# EAGLE schematic main (EAGLE 9.4.2)
CNAME: Arduino Sousvide; CREVISION: v1.1; DESIGNER: SSE
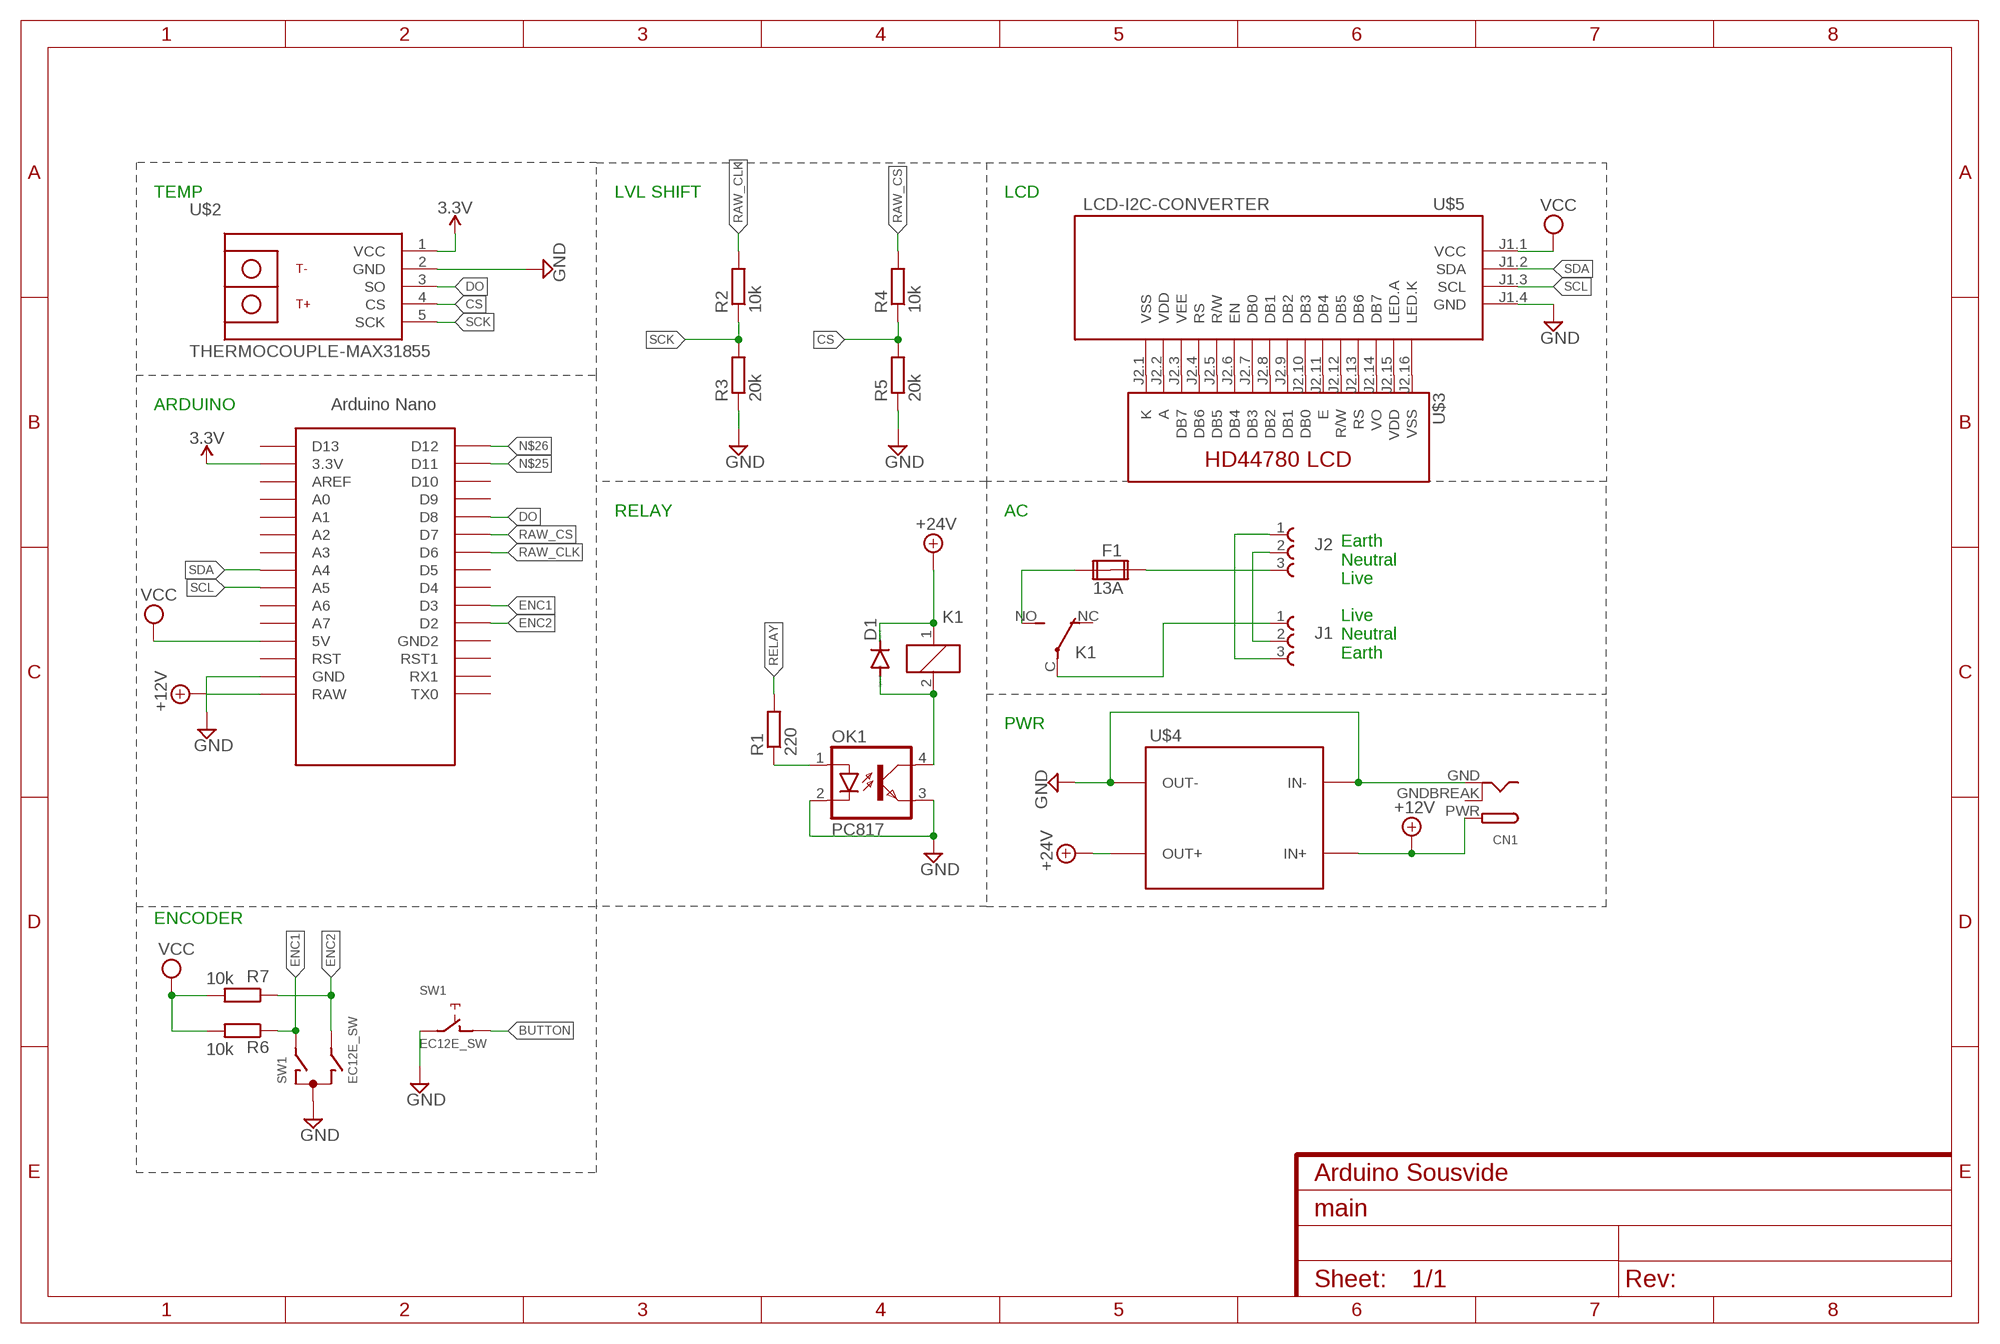
[diagram p0: schematic, sheet 1]

## Parts
CN1  DCBARRELPTH  [DCJACK_2MM_PTH]
D1  1N4004  [DO41-10]
F1  13A  FUSE2P  [FUSE1]
J1  691241710003  [691241710003]
J2  691241710003  [691241710003]
K1  CQ1-12V  [CQ1]
OK1  PC817  [DIL04]
R1  220  R-EU_0207/7  [0207/7]
R2  10k  R-EU_0207/7  [0207/7]
R3  20k  R-EU_0207/7  [0207/7]
R4  10k  R-EU_0207/7  [0207/7]
R5  20k  R-EU_0207/7  [0207/7]
R6  10k  R-EU_0207/7  [0207/7]
R7  10k  R-EU_0207/7  [0207/7]
SW1  EC12E_SW  [ALPS_EC12E_SW]
U$1  NANO  [NANO]
U$2  THERMOCOUPLE-MAX31855  [THERMOCOUPLE-MAX31855]
U$3  LCD-HD4478016X2-4-HOLES-BL16X2-4-HOLES-BL  [LCD-16X2-4HOLES-BL]
U$4  DC-DC-STEP-DOWN-LM2596  [DC-DC-STEP-DOWN-LM2596]
U$5  LCD-I2C-CONVERTER  [LCD-I2C-CONVERTER]

## Nets
3.3V: U$1.3.3V U$2.1(VCC)
+12V: CN1.PWR U$1.RAW U$4.IN+
+24V: D1.C K1.1 U$4.OUT+
BUTTON: SW1.D
CS: R4.1 R5.2 U$2.4(CS)
DO: U$1.D8 U$2.3(SO)
ENC1: R6.1 SW1.A U$1.D3
ENC2: R7.1 SW1.B U$1.D2
GND: CN1.GND OK1.2(C) OK1.3(EMIT) R3.1 R5.1 SW1.C SW1.E U$1.GND U$2.2(GND) U$4.IN- U$4.OUT- U$5.J1.4(GND)
N$1: D1.A K1.2 OK1.4(COL)
N$2: OK1.1(A) R1.1
N$3: J1.2 J2.2
N$4: F1.1A K1.NO(2:S)
N$5: J1.3 J2.1
N$6: J1.1 K1.C(2:P)
N$7: F1.2A J2.3
N$8: U$3.15(A) U$5.J2.2(VDD)
N$9: U$3.7(DB0) U$5.J2.10(DB3)
N$10: U$3.8(DB1) U$5.J2.9(DB2)
N$11: U$3.9(DB2) U$5.J2.8(DB1)
N$12: U$3.10(DB3) U$5.J2.7(DB0)
N$13: U$3.11(DB4) U$5.J2.6(EN)
N$14: U$3.12(DB5) U$5.J2.5(R/W)
N$15: U$3.13(DB6) U$5.J2.4(RS)
N$16: U$3.14(DB7) U$5.J2.3(VEE)
N$17: U$3.6(E) U$5.J2.11(DB4)
N$18: U$3.16(K) U$5.J2.1(VSS)
N$19: U$3.5(R/W) U$5.J2.12(DB5)
N$20: U$3.4(RS) U$5.J2.13(DB6)
N$21: U$3.2(VDD) U$5.J2.15(LED.A)
N$22: U$3.3(VO) U$5.J2.14(DB7)
N$23: U$3.1(VSS) U$5.J2.16(LED.K)
N$25: U$1.D11
N$26: U$1.D12
RAW_CLK: R2.2 U$1.D6
RAW_CS: R4.2 U$1.D7
RELAY: R1.2
SCK: R2.1 R3.2 U$2.5(SCK)
SCL: U$1.A5 U$5.J1.3(SCL)
SDA: U$1.A4 U$5.J1.2(SDA)
VCC: R6.2 R7.2 U$1.5V U$5.J1.1(VCC)
Unconnected: F1.1B F1.2B K1.NC(2:O) SW1.GND1(G) SW1.GND2(G) U$1.A0 U$1.A1 U$1.A2 U$1.A3 U$1.A6 U$1.A7 U$1.AREF U$1.D4 U$1.D5 U$1.D9 U$1.D10 U$1.D13 U$1.GND1(GND2) U$1.ICSP1 U$1.ICSP2 U$1.ICSP3 U$1.ICSP4 U$1.ICSP5 U$1.ICSP6 U$1.RST U$1.RST1 U$1.RX1 U$1.TX0

## Notes on the sheet
- TEMP | LVL SHIFT | LCD
- ARDUINO
- RELAY | AC
- Earth
  Neutral
  Live
  
  Live
  Neutral
  Earth
- PWR
- ENCODER

## Power pins joined to a net without a drawn wire
GNDBREAK: CN1.GNDBREAK

## Library data of the parts
CN1 = adafruit:DCBARREL: 2.0mm DC Barrel Jack DCJACK_2MM_PTH - Through Hole Jack (4UConnector: 05537)
D1 = diode:1N4004: DIODE general purpose rectifier, 1 A
F1 = special:FUSE2P: FUSE 5 x 20 mm
J1 J2 = Wurth_Elektronik_Electromechanic_Terminal_Blocks_Connectors_rev19b:691241710003: SERIE 2417 - 5.00 MM - HORIZONTAL CABLE ENTRY WITH RISING CAGE CLAMP - WR-TBL =>ConTBL2 691241710003 Characteristics INSULATOR:PA6/66 FLAMABILITY RATING: UL94V0 COLOR: GREEN METAL HOUSING: COPPER ALLOY / Ni+Sn TERMINAL SCREW: STEEL / Zn WIRE GUARD: COPPER ALLOY / Ni+Sn FLANGES NUT: BRASS M2.5 OPERATING TEMPERATURE:-30°C UP TO +120°C COMPLIANCE: LEAD FREE AND ROHS ELECTRICAL UL VDE CURRENT RATING: 14A 14A WORKING VOLTAGE: 300VAC 250VAC WITHSTANDING VOLTAGE: 1,6KV 2KV CONTACT RESISTANCE: 20 mOhm max <http://katalog.we-online.de/media/images/v2/Family_WR-TBL_5_00_2417_HORIZONTAL_CABLE_ENTRY_6912417100XX.jpg> Details see: http://katalog.we-online.de/en/em/TBL_5_00_2417_HORIZONTAL_CABLE_ENTRY_W_RISING_CLAMP_6912417100XX 2015 (C) Wurth Elektronik
K1 = relay:CQ1-12V: AUTOMOTIVE QUIET RELAY NAiS Source: http://www.mew-europe.com/.. en_ds_61208_0000.pdf; OC_FARNELL: unknown; OC_NEWARK: unknown
OK1 = optocoupler:PC817: SHARP OPTO COUPLER; MPN: PC817X4J000F; OC_FARNELL: 9707727; OC_NEWARK: 97K7059
R1-R7 = rcl:R-EU_: RESISTOR, European symbol; SPICEPREFIX: R
SW1 = switch-alps:EC12E_SW: ALPS rotary Encoder EC12E series with switch; MPN: EC12E2424407; OC_FARNELL: 1520813; OC_NEWARK: 74M1068
U$1 = Arduino-clone:NANO: Arduino Nano
U$2 = i2clcd:THERMOCOUPLE-MAX31855: Thermocouple Analog-to-Digital Converter based on MAX31855 chip MAX31855 datasheet available here: https://www.maximintegrated.com/en/products/analog/sensors-and-sensor-interface/MAX31855.html Click here to find device on ebay.com <http://www.ebay.com/sch/max31855k+module>
U$3 = HD44780LCD:LCD-HD44780
U$4 = i2clcd:DC-DC-STEP-DOWN-LM2596: DC/DC Step-Down Regulator based on LM2596-ADJ chip LM2596 datasheet available here: http://www.ti.com/lit/ds/symlink/lm2596.pdf Click here to find device on ebay.com <http://www.ebay.com/sch/lm2596+power+regulator>
U$5 = i2clcd:LCD-I2C-CONVERTER: I2C Bus to 4-Bit Parallel LCD Interface with LED backlight driver